# Altium schematic sheet Sheet1.SchDoc
size A4
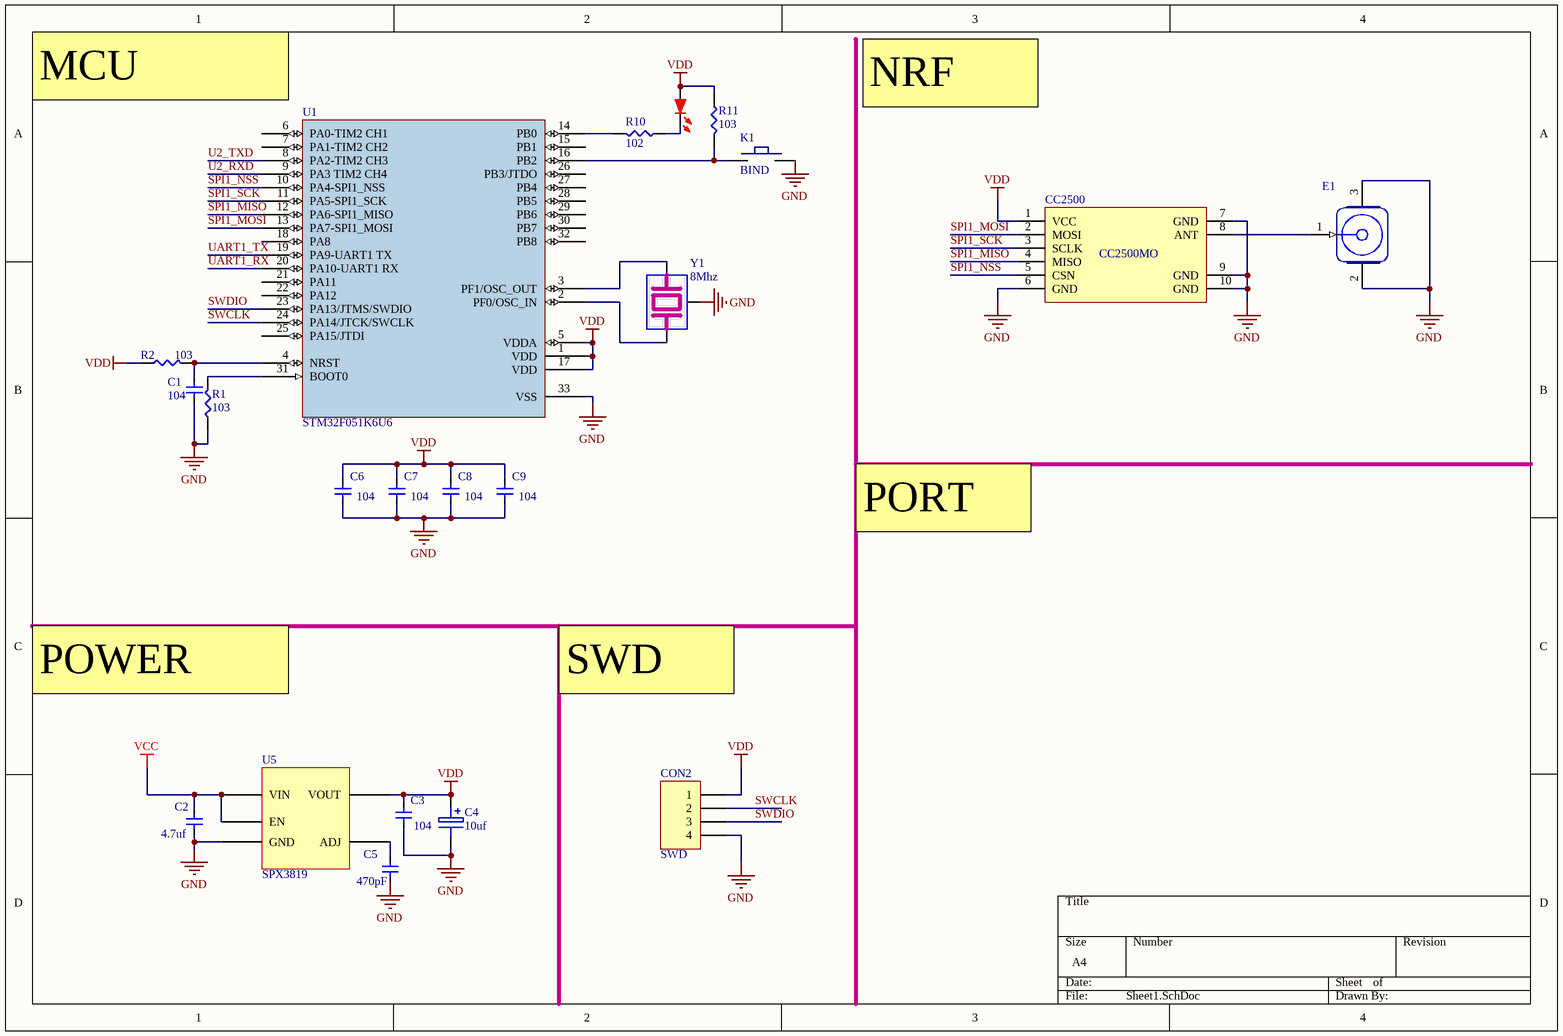
[diagram p0: Sheet1.SchDoc]

## Parts
C1  104  [0603C]
C2  4.7uf  [0603C]
C3  104  [0603C]
C4  10uf  [1206C]
C5  470pF  [0603C]
C6  104  [0603C]
C7  104  [0603C]
C8  104  [0603C]
C9  104  [0603C]
CC2500  CC2500  (value not drawn)
CON2  SWD  [HDR1X4]
D1  LED-R  [0603C]  (value not drawn)
E1  U.FL-LP Hirose Micro RF Connector  [U.FL-LP(V)-040]  (value not drawn)
K1  BIND  [KEY_3x3x2mm]
R1  103  [0603R]
R2  103  [0603R]
R10  102  [0603R]
R11  103  [0603R]
U1  STM32F051K6U6  [QFN32_1GND]
U5  SPX3819  [SOT-23-5]
Y1  8Mhz  [XTAL_mini]

## Nets
GND: C1.2 C2.2 C3.2 C4.2 C5.2 C6.2 C7.2 C8.2 C9.2 CC2500.6(GND) CC2500.7(GND) CC2500.9(GND) CC2500.10(GND) CON2.4 E1.2(GND) E1.3(GND) K1.2 R1.1 U1.33(VSS) U5.2(GND) Y1.2
VCC: C2.1 U5.1(VIN) U5.3(EN)
VDD: C3.1 C4.1 C6.1 C7.1 C8.1 C9.1 CC2500.1(VCC) CON2.1 D1.1(A) R2.1 R11.1 U1.1(VDD) U1.5(VDDA) U1.17(VDD) U5.5(VOUT)
SPI1_MISO: CC2500.4(MISO) U1.12(PA6-SPI1_MISO)
SPI1_MOSI: CC2500.2(MOSI) U1.13(PA7-SPI1_MOSI)
SPI1_NSS: CC2500.5(CSN) U1.10(PA4-SPI1_NSS)
SPI1_SCK: CC2500.3(SCLK) U1.11(PA5-SPI1_SCK)
SWCLK: CON2.2 U1.24(PA14/JTCK/SWCLK)
SWDIO: CON2.3 U1.23(PA13/JTMS/SWDIO)
U2_RXD: U1.9(PA3_TIM2_CH4)
U2_TXD: U1.8(PA2-TIM2_CH3)
UART1_RX: U1.20(PA10-UART1_RX)
UART1_TX: U1.19(PA9-UART1_TX)
NetC1_1: C1.1 R2.2 U1.4(NRST)
NetC5_1: C5.1 U5.4(ADJ)
NetCC2500_8: CC2500.8(ANT) E1.1(Signal)
NetD1_2: D1.2(K) R10.1
NetK1_1: K1.1 R11.2 U1.16(PB2)
NetR1_2: R1.2 U1.31(BOOT0)
NetR10_2: R10.2 U1.14(PB0)
NetU1_2: U1.2(PF0/OSC_IN) Y1.1
NetU1_3: U1.3(PF1/OSC_OUT) Y1.3

Not connected (* = marked no-connect by the designer): U1 6(PA0-TIM2_CH1) 7(PA1-TIM2_CH2) 15(PB1) 18(PA8) 21(PA11) 22(PA12) 25(PA15/JTDI) 26(PB3/JTDO) 27(PB4) 28(PB5) 29(PB6) 30(PB7) 32(PB8)

## Notes on the sheet
- (near U1) MCU
- NRF
- PORT
- POWER
- SWD
- (in symbol CC2500) CC2500MO

## Library data of the parts
C1-C3 C5-C9 = CAP: Capacitor
C4 = ELECTRO1: Electrolytic Capacitor
CON2 = Header 4: Header, 4-Pin; LatestRevisionDate: 17-Jul-2002; LatestRevisionNote: Re-released for DXP Platform.; Publisher: Altium Limited
E1 = U.FL-LP(V)-040: Hirose U.FL-LP(V)-040  Micro RF connector,  50 Ohm Impedance; Manufacturer PN: U.FL-R-SMT-1; PCB_Layout: Complies with manufacturer's recommendation.; DatasheetDocument: 30-May-2003; PackageDocument: 04-Jul-1999; PackageReference: U.FL-LP(V); ComponentLink1Description: Manufacturer Link; ComponentLink2Description: Datasheet; Manufacturer: Hirose; Price 10k: 0; Price 100: 0; Price 100k: 0; Price 1000: 0; AssemblyType: SMD_1; Supplier 1: DigiKey; REACH: OK; REACH Reference: DigiKey Ref - Unaffected Sep-2011; Supplier 1 PN: H11891CT-ND
K1 = KEY
R1 R2 R10 R11 = RES0
U1 = STM32F103CBT6: STM32 ARM-based 32-bit MCU with 128 Kbytes Flash, 48-pin LQFP, Industrial Temperature; Published: 30-May-2008; DatasheetVersion: rev6, Mar-2008; PackageVersion: Mar-2008; PackageReference: LQFP48; Publisher: Altium Limited; PackageDescription: 48-Pin Low-Profile Quad Flat Pack, 7 x 7 mm Body, 0.5 mm Pitch (LQFP48); ComponentLink1Description: Manufacturer Link; ComponentLink1URL: www.st.com/stm32; ComponentLink2Description: Datasheet; ComponentLink2URL: http://www.st.com/stonline/products/literature/ds/13587.pdf; Supplier 1: Digi-Key; Supplier Part Number 1: 497-6288-ND
Y1 = XTAL